# EAGLE schematic cable-adapter-24 (EAGLE 6.5.0)
DESIGNER: JONNEW, MWL@MIT; DESIGN_NAME: Cable adapter 24; LICENSE: (C) Jon Newman CC BY-SA-NC 4.0
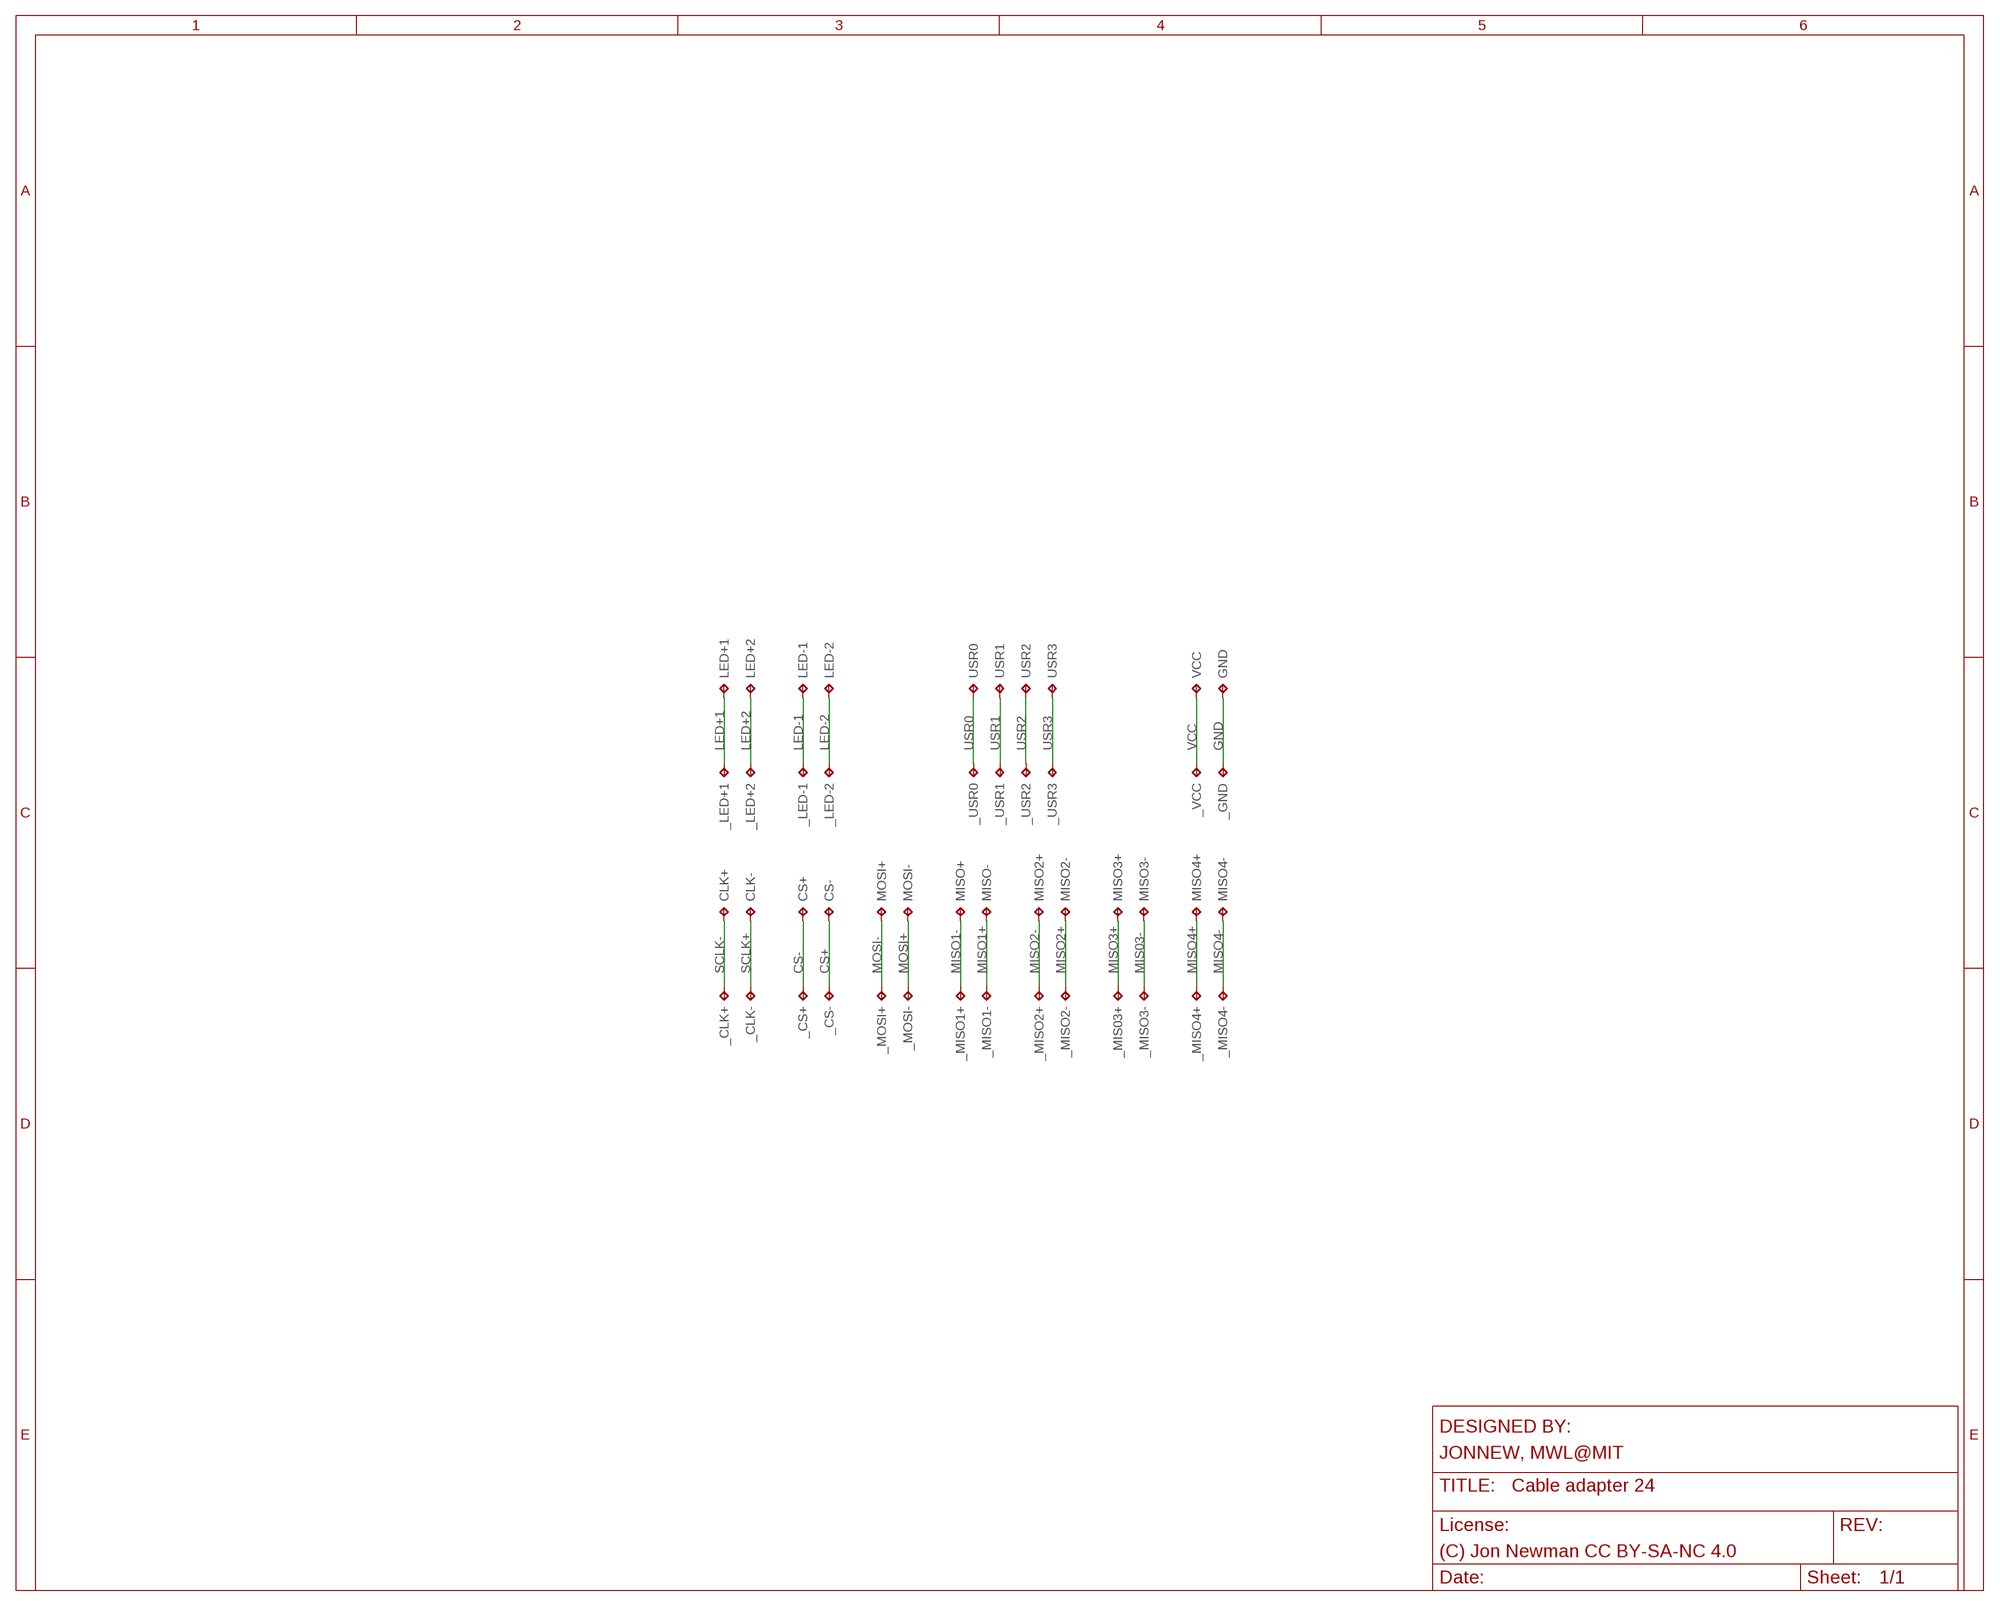
[diagram p0: schematic, sheet 1]

## Parts
_CLK+  TP_SPI_WIRE+  [SPI_WIRE+]
_CLK-  TP_SPI_WIRE+  [SPI_WIRE+]
_CS+  TP_SPI_WIRE+  [SPI_WIRE+]
_CS-  TP_SPI_WIRE+  [SPI_WIRE+]
_GND  TP_SPI_WIRE+  [SPI_WIRE+]
_LED+1  TP_SPI_WIRE+  [SPI_WIRE+]
_LED+2  TP_SPI_WIRE+  [SPI_WIRE+]
_LED-1  TP_SPI_WIRE+  [SPI_WIRE+]
_LED-2  TP_SPI_WIRE+  [SPI_WIRE+]
_MIS03+  TP_SPI_WIRE+  [SPI_WIRE+]
_MISO1+  TP_SPI_WIRE+  [SPI_WIRE+]
_MISO1-  TP_SPI_WIRE+  [SPI_WIRE+]
_MISO2+  TP_SPI_WIRE+  [SPI_WIRE+]
_MISO2-  TP_SPI_WIRE+  [SPI_WIRE+]
_MISO3-  MISO3+  TP_SPI_WIRE+  [SPI_WIRE+]
_MISO4+  TP_SPI_WIRE+  [SPI_WIRE+]
_MISO4-  TP_SPI_WIRE+  [SPI_WIRE+]
_MOSI+  TP_SPI_WIRE+  [SPI_WIRE+]
_MOSI-  TP_SPI_WIRE+  [SPI_WIRE+]
_USR0  TP_SPI_WIRE+  [SPI_WIRE+]
_USR1  TP_SPI_WIRE+  [SPI_WIRE+]
_USR2  TP_SPI_WIRE+  [SPI_WIRE+]
_USR3  TP_SPI_WIRE+  [SPI_WIRE+]
_VCC  TP_SPI_WIRE+  [SPI_WIRE+]
CLK+  TP_SPI_WIRE+  [SPI_WIRE+]
CLK-  TP_SPI_WIRE+  [SPI_WIRE+]
CS+  TP_SPI_WIRE+  [SPI_WIRE+]
CS-  TP_SPI_WIRE+  [SPI_WIRE+]
GND  TP_SPI_WIRE+  [SPI_WIRE+]
LED+1  TP_SPI_WIRE+  [SPI_WIRE+]
LED+2  TP_SPI_WIRE+  [SPI_WIRE+]
LED-1  TP_SPI_WIRE+  [SPI_WIRE+]
LED-2  TP_SPI_WIRE+  [SPI_WIRE+]
MISO2+  TP_SPI_WIRE+  [SPI_WIRE+]
MISO2-  TP_SPI_WIRE+  [SPI_WIRE+]
MISO3+  TP_SPI_WIRE+  [SPI_WIRE+]
MISO3-  TP_SPI_WIRE+  [SPI_WIRE+]
MISO4+  TP_SPI_WIRE+  [SPI_WIRE+]
MISO4-  TP_SPI_WIRE+  [SPI_WIRE+]
MISO+  TP_SPI_WIRE+  [SPI_WIRE+]
MISO-  TP_SPI_WIRE+  [SPI_WIRE+]
MOSI+  TP_SPI_WIRE+  [SPI_WIRE+]
MOSI-  TP_SPI_WIRE+  [SPI_WIRE+]
USR0  TP_SPI_WIRE+  [SPI_WIRE+]
USR1  TP_SPI_WIRE+  [SPI_WIRE+]
USR2  TP_SPI_WIRE+  [SPI_WIRE+]
USR3  TP_SPI_WIRE+  [SPI_WIRE+]
VCC  TP_SPI_WIRE+  [SPI_WIRE+]

## Nets
CS+: _CS-.P$1(TP) CS-.P$1(TP)
CS-: _CS+.P$1(TP) CS+.P$1(TP)
GND: _GND.P$1(TP) GND.P$1(TP)
LED+1: _LED+1.P$1(TP) LED+1.P$1(TP)
LED+2: _LED+2.P$1(TP) LED+2.P$1(TP)
LED-1: _LED-1.P$1(TP) LED-1.P$1(TP)
LED-2: _LED-2.P$1(TP) LED-2.P$1(TP)
MIS03-: _MISO3-.P$1(TP) MISO3-.P$1(TP)
MISO1+: _MISO1-.P$1(TP) MISO-.P$1(TP)
MISO1-: _MISO1+.P$1(TP) MISO+.P$1(TP)
MISO2+: _MISO2-.P$1(TP) MISO2-.P$1(TP)
MISO2-: _MISO2+.P$1(TP) MISO2+.P$1(TP)
MISO3+: _MIS03+.P$1(TP) MISO3+.P$1(TP)
MISO4+: _MISO4+.P$1(TP) MISO4+.P$1(TP)
MISO4-: _MISO4-.P$1(TP) MISO4-.P$1(TP)
MOSI+: _MOSI-.P$1(TP) MOSI-.P$1(TP)
MOSI-: _MOSI+.P$1(TP) MOSI+.P$1(TP)
SCLK+: _CLK-.P$1(TP) CLK-.P$1(TP)
SCLK-: _CLK+.P$1(TP) CLK+.P$1(TP)
USR0: _USR0.P$1(TP) USR0.P$1(TP)
USR1: _USR1.P$1(TP) USR1.P$1(TP)
USR2: _USR2.P$1(TP) USR2.P$1(TP)
USR3: _USR3.P$1(TP) USR3.P$1(TP)
VCC: _VCC.P$1(TP) VCC.P$1(TP)

## Library data of the parts
_CLK+ _CLK- _CS+ _CS- _GND _LED+1 _LED+2 _LED-1 _LED-2 _MIS03+ _MISO1+ _MISO1- _MISO2+ _MISO2- _MISO3- _MISO4+ _MISO4- _MOSI+ _MOSI- _USR0 _USR1-_USR3 _VCC CLK+ CLK- CS+ CS- GND LED+1 LED+2 LED-1 LED-2 MISO2+ MISO2- MISO3+ MISO3- MISO4+ MISO4- MISO+ MISO- MOSI+ MOSI- USR0 USR1-USR3 VCC = jonnew:TP: Test pad